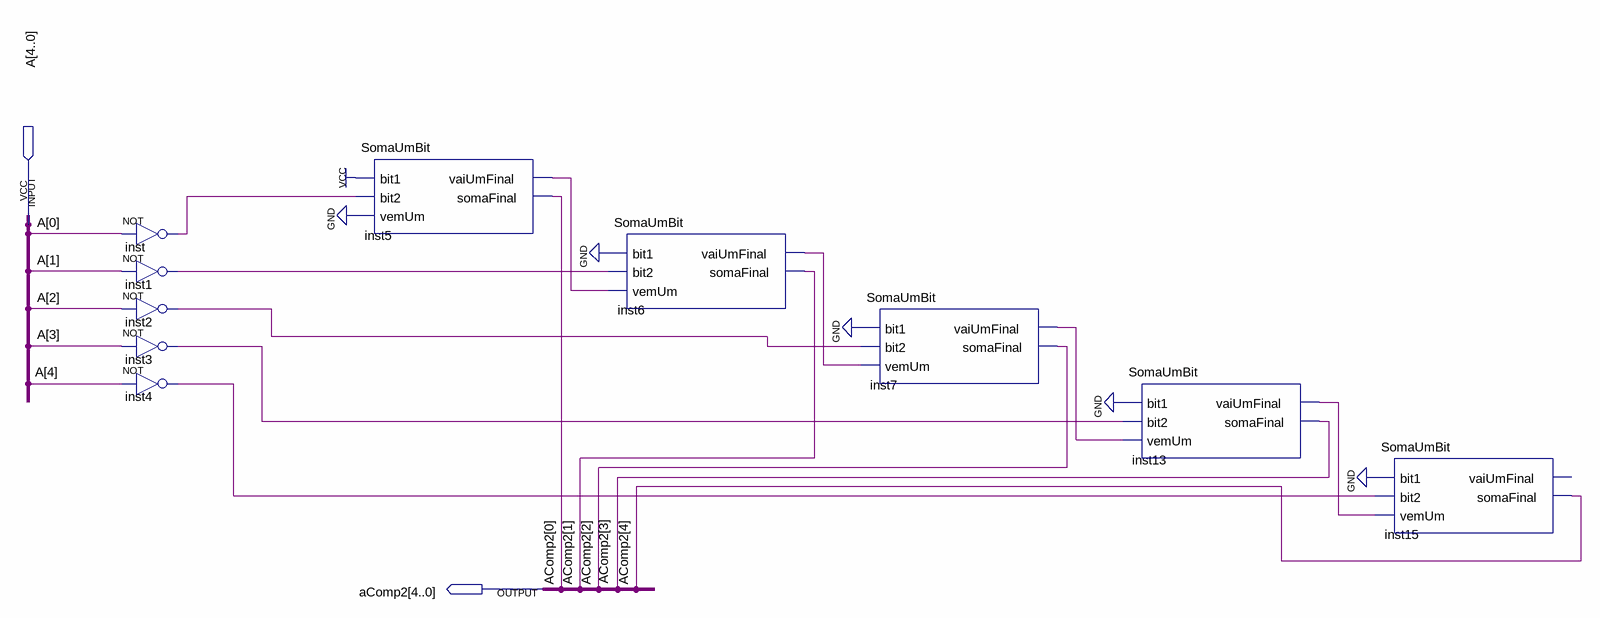
[diagram p0: schematic sheet]
// Quartus schematic Complemento2Para5Bits.bdf as structural Verilog: 10 symbols, 2 pins
module Complemento2Para5Bits (
  input  [4:0] A,
  output [4:0] aComp2
);

  wire inst1_out, inst2_out, inst3_out, inst4_out, inst5_vaiumfinal, inst6_vaiumfinal, inst7_vaiumfinal,
       inst13_vaiumfinal, inst_out;

  not inst (inst_out, A[0]);
  not inst1 (inst1_out, A[1]);
  not inst2 (inst2_out, A[2]);
  not inst3 (inst3_out, A[3]);
  not inst4 (inst4_out, A[4]);
  SomaUmBit inst5 (.bit1(1'b1), .bit2(inst_out), .vemUm(1'b0), .vaiUmFinal(inst5_vaiumfinal), .somaFinal(aComp2[0]));
  SomaUmBit inst6 (
    .bit1(1'b0), .bit2(inst1_out), .vemUm(inst5_vaiumfinal), .vaiUmFinal(inst6_vaiumfinal),
    .somaFinal(aComp2[1]));
  SomaUmBit inst7 (
    .bit1(1'b0), .bit2(inst2_out), .vemUm(inst6_vaiumfinal), .vaiUmFinal(inst7_vaiumfinal),
    .somaFinal(aComp2[2]));
  SomaUmBit inst13 (
    .bit1(1'b0), .bit2(inst3_out), .vemUm(inst7_vaiumfinal), .vaiUmFinal(inst13_vaiumfinal),
    .somaFinal(aComp2[3]));
  SomaUmBit inst15 (
    .bit1(1'b0), .bit2(inst4_out), .vemUm(inst13_vaiumfinal), .somaFinal(aComp2[4]));  // open: vaiUmFinal
endmodule
